# Altium schematic sheet pico.SchDoc
size B; Address1: MILWAUKEE TOOL; Address2: 13135 W. Lisbon Rd.; Address3: Brookfield, WI 53005; SheetNumber: 1; SheetTotal: 1
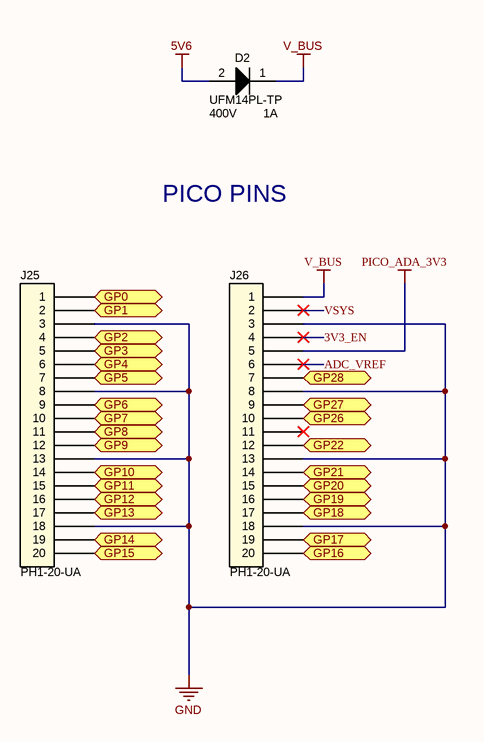
[diagram p0: pico.SchDoc]

## Parts
D2  UFM14PL-TP  Current Rating: 1A  Voltage Rating: 400V  [SODFL358X135-2N]
J25  PH1-20-UA  [CONN_ADAM_TECH_PH1-20-UA]
J26  PH1-20-UA  [CONN_ADAM_TECH_PH1-20-UA]

## Ports
GP0 (bidir), GP1 (bidir), GP2 (bidir), GP3 (bidir), GP4 (bidir), GP5 (bidir), GP6 (bidir), GP7 (bidir), GP8 (bidir), GP9 (bidir), GP10 (bidir), GP11 (bidir), GP12 (bidir), GP13 (bidir), GP14 (bidir), GP15 (bidir), GP16 (bidir), GP17 (bidir), GP18 (bidir), GP19 (bidir), GP20 (bidir), GP21 (bidir), GP22 (bidir), GP26 (bidir), GP27 (bidir), GP28 (bidir)

## Nets
5V6: D2.2(Anode)
GND: J25.3 J25.8 J25.13 J25.18 J26.3 J26.8 J26.13 J26.18
PICO_ADA_3V3: J26.5
V_BUS: D2.1(Cathode) J26.1
3V3_EN: J26.4
ADC_VREF: J26.6
GP0: J25.1 ; port GP0
GP1: J25.2 ; port GP1
GP2: J25.4 ; port GP2
GP3: J25.5 ; port GP3
GP4: J25.6 ; port GP4
GP5: J25.7 ; port GP5
GP6: J25.9 ; port GP6
GP7: J25.10 ; port GP7
GP8: J25.11 ; port GP8
GP9: J25.12 ; port GP9
GP10: J25.14 ; port GP10
GP11: J25.15 ; port GP11
GP12: J25.16 ; port GP12
GP13: J25.17 ; port GP13
GP14: J25.19 ; port GP14
GP15: J25.20 ; port GP15
GP16: J26.20 ; port GP16
GP17: J26.19 ; port GP17
GP18: J26.17 ; port GP18
GP19: J26.16 ; port GP19
GP20: J26.15 ; port GP20
GP21: J26.14 ; port GP21
GP22: J26.12 ; port GP22
GP26: J26.10 ; port GP26
GP27: J26.9 ; port GP27
GP28: J26.7 ; port GP28
VSYS: J26.2

Not connected (* = marked no-connect by the designer): J26 11*

## Notes on the sheet
- PICO PINS
- Schematic Notes
- Schematic Revision History
- Title
- ALL CAPACITORS ARE CERAMIC, 0603, 50V, 10%, X7R UNLESS OTHERWISE STATED
- ALL RESISTORS ARE FILM, 0603, 1/10W, 5%, 200ppm/°C UNLESS OTHERWISE STATED
- Size:
- Date:
- B
- Number:
- Sheet
- Revision:
- of
- Drawn By:
- Brookfield, WI 53005
- File:
- Platform Base:
- Engineer:
- This Document is the property of MILWAUKEE TOOL and may not be reproduced, in any form, without the written premission of MILWAUKEE TOOL.

## Library data of the parts
D2 = CMP-010-0012: DIODE GEN PURP 400V 1A SOD123FL; MFR: Micro Commercial Co; Voltage, Forward: 1.4V @1A; Rth(j-a): 80 C/W; Current, Reverse Leakage: 50uA @VR=400V,Tj=125C; Temp Range: -65 / +150 C; Wattage: 400mW; Value: UFM14PL; ComponentLink1URL: https://www.mccsemi.com/pdf/Products/UFM11PL-UFM17PL(SOD-123FL).pdf; MFR#: UFM14PL-TP; Design Item ID: D/REC/400V/1A/UFM14PL/SOD123FL; Case/Package: SOD123FL; ComponentLink1Description: Datasheet
J25 J26 = CMP-007-0067: CONN HEADER VERT 20POS 2.54MM GOLD; MFR: Adam Tech; Voltage Rating: 250V AC(RMS)/DC; Durability: 50 mating cycles; Current Rating: 1A; System: Connector; Temp Range: -40 / +105 C; Gender: Male; Value: PH1-20-UA; Orientation: Verticle; Terminal Pitch: 2.54mm; RoHS Compliant: Yes; Design Item ID: CON/20P/2.54mm/2A/PH1-20-UA/Adam Tech; MFR#: PH1-20-UA; Contact Finish: Gold; ComponentLink1Description: Drawing; ComponentLink1URL: https://app.adam-tech.com/products/download/data_sheet/201605/ph1-xx-ua-data-sheet.pdf